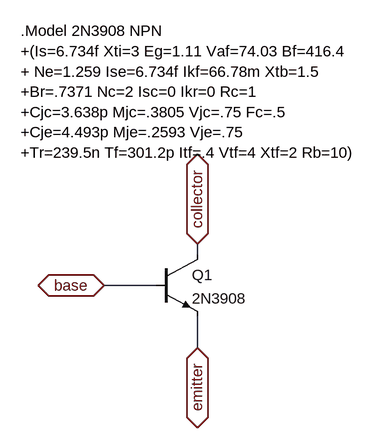
[diagram p0: schematic 2n3908.asc]
2n3908.asc, the LTspice schematic file:
Version 4
SHEET 1 880 680
WIRE 80 240 80 224
WIRE 16 288 -64 288
WIRE 80 384 80 336
FLAG 80 224 collector
IOPIN 80 224 BiDir
FLAG -64 288 base
IOPIN -64 288 BiDir
FLAG 80 384 emitter
IOPIN 80 384 BiDir
SYMBOL npn 16 240 R0
SYMATTR InstName Q1
SYMATTR Value 2N3908
TEXT -192 -104 Left 0 !.Model 2N3908 NPN \n+(Is=6.734f Xti=3 Eg=1.11 Vaf=74.03 Bf=416.4\n+ Ne=1.259 Ise=6.734f Ikf=66.78m Xtb=1.5 \n+Br=.7371 Nc=2 Isc=0 Ikr=0 Rc=1 \n+Cjc=3.638p Mjc=.3805 Vjc=.75 Fc=.5 \n+Cje=4.493p Mje=.2593 Vje=.75 \n+Tr=239.5n Tf=301.2p Itf=.4 Vtf=4 Xtf=2 Rb=10)

The netlist it stands for:
* 2n3908.asc
Q1 collector base emitter 0 2N3908
.model NPN NPN
.model PNP PNP
.lib standard.bjt
.Model 2N3908 NPN
+(Is=6.734f Xti=3 Eg=1.11 Vaf=74.03 Bf=416.4
+ Ne=1.259 Ise=6.734f Ikf=66.78m Xtb=1.5
+Br=.7371 Nc=2 Isc=0 Ikr=0 Rc=1
+Cjc=3.638p Mjc=.3805 Vjc=.75 Fc=.5
+Cje=4.493p Mje=.2593 Vje=.75
+Tr=239.5n Tf=301.2p Itf=.4 Vtf=4 Xtf=2 Rb=10)
.backanno
.end